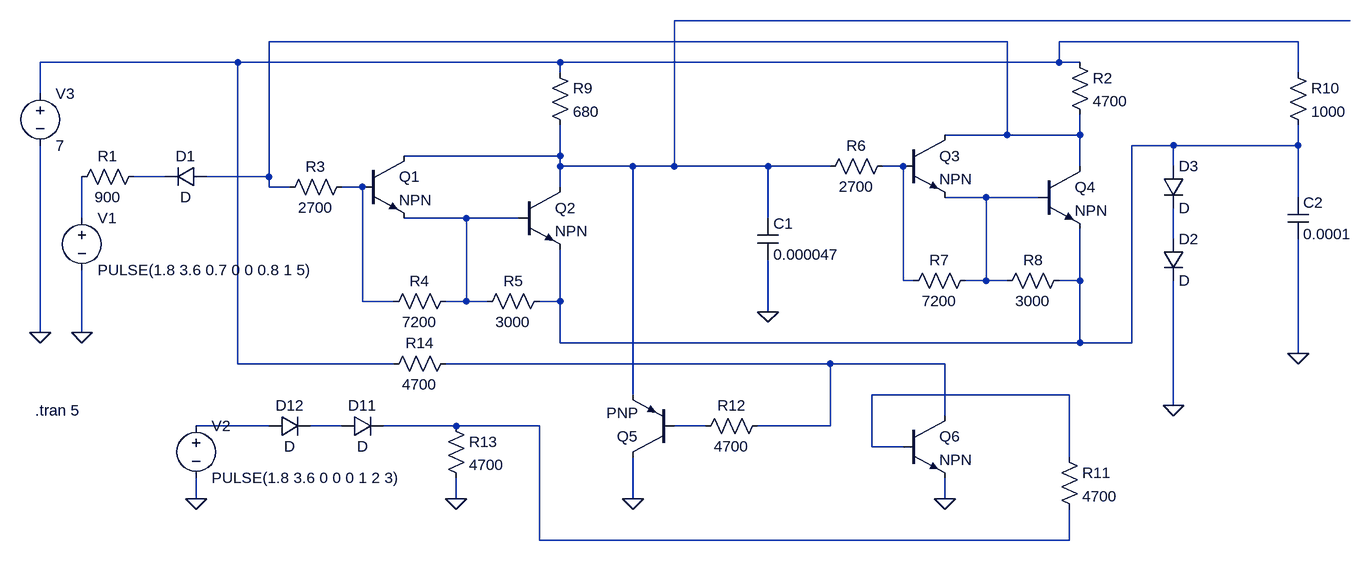
[diagram p0: schematic watchcd.asc]
watchcd.asc, the LTspice schematic file:
Version 4
SHEET 1 2316 784
WIRE 2112 -64 1072 -64
WIRE 1584 -32 448 -32
WIRE 2032 -32 1664 -32
WIRE 400 0 96 0
WIRE 896 0 400 0
WIRE 1664 0 1664 -32
WIRE 1664 0 896 0
WIRE 1696 0 1664 0
WIRE 896 16 896 0
WIRE 2032 16 2032 -32
WIRE 96 48 96 0
WIRE 1584 112 1584 -32
WIRE 1584 112 1488 112
WIRE 1696 112 1696 80
WIRE 1696 112 1584 112
WIRE 1840 128 1776 128
WIRE 2032 128 2032 96
WIRE 2032 128 1840 128
WIRE 896 144 896 96
WIRE 896 144 656 144
WIRE 896 160 896 144
WIRE 1008 160 896 160
WIRE 1072 160 1072 -64
WIRE 1072 160 1008 160
WIRE 1216 160 1072 160
WIRE 1312 160 1216 160
WIRE 1424 160 1392 160
WIRE 1696 160 1696 112
WIRE 1840 160 1840 128
WIRE 288 176 240 176
WIRE 448 176 448 -32
WIRE 448 176 352 176
WIRE 448 192 448 176
WIRE 480 192 448 192
WIRE 592 192 560 192
WIRE 896 192 896 160
WIRE 1552 208 1488 208
WIRE 1632 208 1552 208
WIRE 2032 208 2032 128
WIRE 160 240 160 176
WIRE 752 240 656 240
WIRE 832 240 752 240
WIRE 1216 240 1216 160
WIRE 1840 272 1840 224
WIRE 1424 336 1424 160
WIRE 1440 336 1424 336
WIRE 1552 336 1552 208
WIRE 1552 336 1520 336
WIRE 1584 336 1552 336
WIRE 1696 336 1696 256
WIRE 1696 336 1664 336
WIRE 592 368 592 192
WIRE 640 368 592 368
WIRE 752 368 752 240
WIRE 752 368 720 368
WIRE 784 368 752 368
WIRE 896 368 896 288
WIRE 896 368 864 368
WIRE 1216 384 1216 304
WIRE 96 416 96 128
WIRE 160 416 160 320
WIRE 896 432 896 368
WIRE 1696 432 1696 336
WIRE 1696 432 896 432
WIRE 1776 432 1776 128
WIRE 1776 432 1696 432
WIRE 2032 448 2032 272
WIRE 400 464 400 0
WIRE 640 464 400 464
WIRE 1312 464 720 464
WIRE 1488 464 1312 464
WIRE 1008 512 1008 160
WIRE 1680 512 1376 512
WIRE 1840 528 1840 336
WIRE 1488 544 1488 464
WIRE 448 560 336 560
WIRE 560 560 512 560
WIRE 736 560 624 560
WIRE 864 560 736 560
WIRE 1120 560 1072 560
WIRE 1312 560 1312 464
WIRE 1312 560 1200 560
WIRE 1376 592 1376 512
WIRE 1424 592 1376 592
WIRE 1680 608 1680 512
WIRE 336 672 336 640
WIRE 736 672 736 640
WIRE 1008 672 1008 608
WIRE 1488 672 1488 640
WIRE 864 736 864 560
WIRE 1680 736 1680 688
WIRE 1680 736 864 736
FLAG 160 416 0
FLAG 336 672 0
FLAG 1840 528 0
FLAG 1216 384 0
FLAG 2032 448 0
FLAG 96 416 0
FLAG 1008 672 0
FLAG 1488 672 0
FLAG 736 672 0
SYMBOL voltage 160 224 R0
WINDOW 123 0 0 Left 2
WINDOW 39 0 0 Left 2
SYMATTR InstName V1
SYMATTR Value PULSE(1.8 3.6 0.7 0 0 0.8 1 5)
SYMBOL res 256 160 R90
WINDOW 0 0 56 VBottom 2
WINDOW 3 32 56 VTop 2
SYMATTR InstName R1
SYMATTR Value 900
SYMBOL diode 352 160 R90
WINDOW 0 0 32 VBottom 2
WINDOW 3 32 32 VTop 2
SYMATTR InstName D1
SYMBOL voltage 336 544 R0
WINDOW 123 0 0 Left 2
WINDOW 39 0 0 Left 2
SYMATTR InstName V2
SYMATTR Value PULSE(1.8 3.6 0 0 0 1 2 3)
SYMBOL res 1680 -16 R0
SYMATTR InstName R2
SYMATTR Value 4700
SYMBOL cap 1200 240 R0
SYMATTR InstName C1
SYMATTR Value 0.000047
SYMBOL npn 592 144 R0
SYMATTR InstName Q1
SYMBOL npn 832 192 R0
SYMATTR InstName Q2
SYMBOL npn 1424 112 R0
SYMATTR InstName Q3
SYMBOL npn 1632 160 R0
SYMATTR InstName Q4
SYMBOL res 576 176 R90
WINDOW 0 0 56 VBottom 2
WINDOW 3 32 56 VTop 2
SYMATTR InstName R3
SYMATTR Value 2700
SYMBOL res 736 352 R90
WINDOW 0 0 56 VBottom 2
WINDOW 3 32 56 VTop 2
SYMATTR InstName R4
SYMATTR Value 7200
SYMBOL res 880 352 R90
WINDOW 0 0 56 VBottom 2
WINDOW 3 32 56 VTop 2
SYMATTR InstName R5
SYMATTR Value 3000
SYMBOL res 1408 144 R90
WINDOW 0 0 56 VBottom 2
WINDOW 3 32 56 VTop 2
SYMATTR InstName R6
SYMATTR Value 2700
SYMBOL res 1536 320 R90
WINDOW 0 0 56 VBottom 2
WINDOW 3 32 56 VTop 2
SYMATTR InstName R7
SYMATTR Value 7200
SYMBOL res 1680 320 R90
WINDOW 0 0 56 VBottom 2
WINDOW 3 32 56 VTop 2
SYMATTR InstName R8
SYMATTR Value 3000
SYMBOL res 880 0 R0
SYMATTR InstName R9
SYMATTR Value 680
SYMBOL diode 1824 272 R0
SYMATTR InstName D2
SYMBOL diode 1824 160 R0
SYMATTR InstName D3
SYMBOL cap 2016 208 R0
SYMATTR InstName C2
SYMATTR Value 0.0001
SYMBOL res 2016 0 R0
SYMATTR InstName R10
SYMATTR Value 1000
SYMBOL pnp 1072 608 R180
SYMATTR InstName Q5
SYMBOL voltage 96 32 R0
WINDOW 123 0 0 Left 2
WINDOW 39 0 0 Left 2
SYMATTR InstName V3
SYMATTR Value 7
SYMBOL res 1216 544 R90
WINDOW 0 0 56 VBottom 2
WINDOW 3 32 56 VTop 2
SYMATTR InstName R12
SYMATTR Value 4700
SYMBOL res 1664 592 R0
SYMATTR InstName R11
SYMATTR Value 4700
SYMBOL res 736 448 R90
WINDOW 0 0 56 VBottom 2
WINDOW 3 32 56 VTop 2
SYMATTR InstName R14
SYMATTR Value 4700
SYMBOL npn 1424 544 R0
SYMATTR InstName Q6
SYMBOL diode 560 576 R270
WINDOW 0 32 32 VTop 2
WINDOW 3 0 32 VBottom 2
SYMATTR InstName D11
SYMBOL diode 448 576 R270
WINDOW 0 32 32 VTop 2
WINDOW 3 0 32 VBottom 2
SYMATTR InstName D12
SYMBOL res 720 544 R0
SYMATTR InstName R13
SYMATTR Value 4700
TEXT 88 536 Left 2 !.tran 5

The netlist it stands for:
* watchcd.asc
V1 N009 0 PULSE(1.8 3.6 0.7 0 0 0.8 1 5)
R1 N006 N009 900
D1 N002 N006 D
V2 N014 0 PULSE(1.8 3.6 0 0 0 1 2 3)
R2 N003 N002 4700
C1 N001 0 0.000047
Q1 N001 N007 N010 0 NPN
Q2 N001 N010 N004 0 NPN
Q3 N002 N005 N008 0 NPN
Q4 N002 N008 N004 0 NPN
R3 N007 N002 2700
R4 N010 N007 7200
R5 N004 N010 3000
R6 N005 N001 2700
R7 N008 N005 7200
R8 N004 N008 3000
R9 N003 N001 680
D2 N011 0 D
D3 N004 N011 D
C2 N004 0 0.0001
R10 N003 N004 1000
Q5 0 N017 N001 0 PNP
V3 N003 0 7
R12 N012 N017 4700
R11 N013 N016 4700
R14 N012 N003 4700
Q6 N012 N013 0 0 NPN
D11 N015 N016 D
D12 N014 N015 D
R13 N016 0 4700
.model D D
.lib standard.dio
.model NPN NPN
.model PNP PNP
.lib standard.bjt
.tran 5
.backanno
.end